# Altium project uz_d_absolute_encoder.PrjPCB
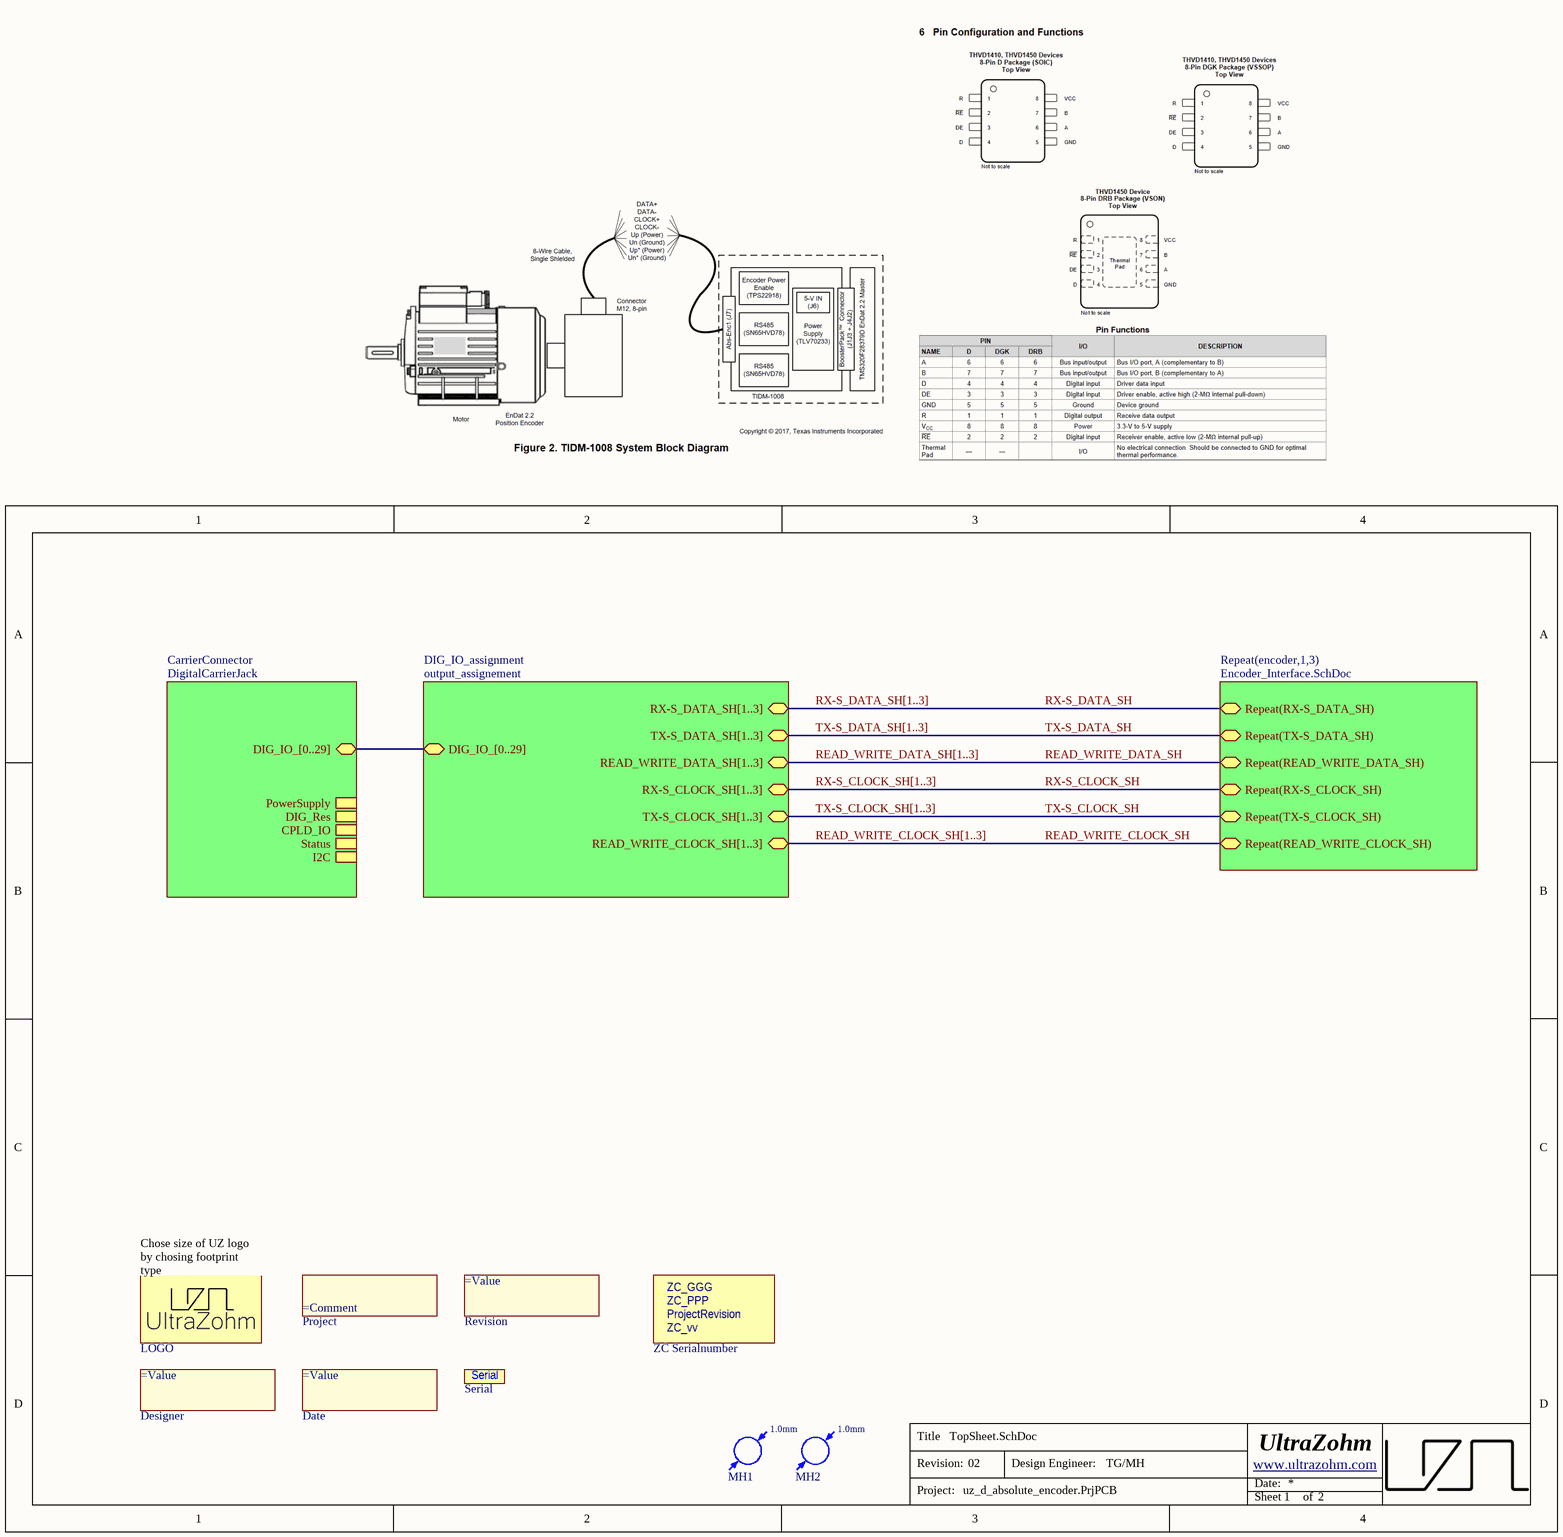
[diagram p0: TopSheet.SchDoc]
ZC_vv: 00; ZC_PPP: 017; ZC_GGG: 000; ProjectRevision: 02; ProjectNameCustom: uz_d_absolute_encoder; FinDate: 05/25; AuthorParam: TG/MH; Author: TG/MH
4 sheets, 211 parts. Net scope: hierarchical (ports join the sheet entries above them; power ports are global).
Board file: uz_d_absolute_encoder.PcbDoc
Sheets:
  TopSheet.SchDoc
    CarrierConnector = DigitalCarrierJack.SchDoc
    DIG_IO_assignment = output_assignement.SchDoc
    encoder1 = Encoder_Interface.SchDoc
    encoder2 = Encoder_Interface.SchDoc
    encoder3 = Encoder_Interface.SchDoc

## Sheet TopSheet.SchDoc
size A4; Author: TG/MH; CompanyName: Technische Hochschule Nürnberg Georg Simon Ohm; Organization: UltraZohm; Address1: Kesslerplatz 12; Address2: 90489 Nürnberg; Address3: GERMANY; DocumentNumber: 1; SheetNumber: 1; SheetTotal: 2; Website: www.ultrazohm.com

### Parts
Date  (no value)  [COMMENT]  (no BOM)
Designer  (no value)  [Designator:comment]  (no BOM)
INFO  ZC Serialnumber  [ZC-Serial]  (no BOM)
LOGO  UZ Logo  [UZ_Logo_small]  (value not drawn)  (no BOM)
MH1  alignment hole 1mm  [MH_1]  (value not drawn)  (no BOM)
MH2  alignment hole 1mm  [MH_1]  (value not drawn)  (no BOM)
Project  (no value)  [COMMENT]  (no BOM)
Revision  (no value)  [Designator:comment]  (no BOM)
Serial  Serial #  [SERIAL]  (value not drawn)  (no BOM)

### Sub-sheets
CarrierConnector = DigitalCarrierJack: PowerSupply (harness DigCon_PowerSupply), DIG_Res (harness DigCon_DIG_Res), CPLD_IO (harness DigCon_DCPLD_IO), Status (harness DigCon_Status), I2C (harness DigCon_I2C), DIG_IO_[0..29] (bidir)
DIG_IO_assignment = output_assignement: TX-S_DATA_SH[1..3] (bidir), READ_WRITE_DATA_SH[1..3] (bidir), RX-S_CLOCK_SH[1..3] (bidir), RX-S_DATA_SH[1..3] (bidir), TX-S_CLOCK_SH[1..3] (bidir), READ_WRITE_CLOCK_SH[1..3] (bidir), DIG_IO_[0..29] (bidir)
Repeat(encoder,1,3) = Encoder_Interface.SchDoc: Repeat(TX-S_DATA_SH) (bidir), Repeat(READ_WRITE_DATA_SH) (bidir), Repeat(RX-S_CLOCK_SH) (bidir), Repeat(RX-S_DATA_SH) (bidir), Repeat(TX-S_CLOCK_SH) (bidir), Repeat(READ_WRITE_CLOCK_SH) (bidir)

### Nets
READ_WRITE_CLOCK_SH: sheet Repeat(encoder,1,3)/Repeat(READ_WRITE_CLOCK_SH)
READ_WRITE_DATA_SH: sheet Repeat(encoder,1,3)/Repeat(READ_WRITE_DATA_SH)
RX-S_CLOCK_SH: sheet Repeat(encoder,1,3)/Repeat(RX-S_CLOCK_SH)
RX-S_DATA_SH: sheet Repeat(encoder,1,3)/Repeat(RX-S_DATA_SH)
TX-S_CLOCK_SH: sheet Repeat(encoder,1,3)/Repeat(TX-S_CLOCK_SH)
TX-S_DATA_SH: sheet Repeat(encoder,1,3)/Repeat(TX-S_DATA_SH)

### Buses and harness runs
bus READ_WRITE_CLOCK_SH[1..3] = sheet DIG_IO_assignment/READ_WRITE_CLOCK_SH[1..3]
bus READ_WRITE_DATA_SH[1..3] = sheet DIG_IO_assignment/READ_WRITE_DATA_SH[1..3]
bus RX-S_CLOCK_SH[1..3] = sheet DIG_IO_assignment/RX-S_CLOCK_SH[1..3]
bus RX-S_DATA_SH[1..3] = sheet DIG_IO_assignment/RX-S_DATA_SH[1..3]
bus sheet CarrierConnector/DIG_IO_[0..29] = sheet DIG_IO_assignment/DIG_IO_[0..29]
bus TX-S_CLOCK_SH[1..3] = sheet DIG_IO_assignment/TX-S_CLOCK_SH[1..3]
bus TX-S_DATA_SH[1..3] = sheet DIG_IO_assignment/TX-S_DATA_SH[1..3]

### Notes on the sheet
- (near LOGO) Chose size of UZ logo by chosing footprint type
- Title
- Revision:
- Design Engineer:
- Date:
- Project:
- Sheet
- of
- (in symbol Mounting Hole - 1mm) 1.0mm
- (in symbol ZC-Serial) ZC_GGG; ZC_PPP; ProjectRevision; ZC_vv

### Library data of the parts
Date = 5: Create a project parameter named "FinDate" this is the value of this component. It is printed on the PCB. Once the parameter is updated (e.g. new revision) it gets updated on the PCB as well; Manufacturer: PCB Manufacturer; Manufacturer Part Number: Project End Date; Value: 05/25; Created from: T. Wendt; PartID: 5; Created On: 01.03.2021 09:01:41; Component Type: Date of Project Finalization; Last Updated: 01.03.2021 09:01:41; Type: Standard (No BOM); Live Cycle Status: 1
Designer = 4: Create a project parameter named "Author" this is the value of this component. It is printed on the PCB. Once the parameter is updated (e.g. new revision) it gets updated on the PCB as well; Manufacturer: PCB Manufacturer; Manufacturer Part Number: Project Author; Value: TG/MH; Created from: T. Wendt; PartID: 4; Created On: 01.03.2021 08:53:41; Component Type: Project Author; Last Updated: 01.03.2021 09:20:27; Type: Standard (No BOM); Live Cycle Status: 1
INFO = ZC-Serial: Manufacturer: UltraZohm; Value: GGG-PPP-VVvv; Created from: FRosner; Manufacturer Part Number: ZC-Serial; PartID: 58; Created On: 15.04.2025 09:17:14; ComponentLink1Description: https://docs.ultrazohm.com/; ComponentLink1URL: homepage; Component Type: ZC Serialnumber; Last Updated: 15.04.2025 09:17:14; Supplier 1: -; Supplier Part Number 1: -; Type: Serial Number; Live Cycle Status: 1
LOGO = 1: Official Project Logo of the UltraZohm; Manufacturer: PCB Manufacturer; Manufacturer Part Number: UltraZohm Logo; Created from: T. Wendt; PartID: 1; Created On: 19.02.2021 16:55:56; ComponentLink1Description: Homepage; ComponentLink1URL: https://ultrazohm.com; Component Type: Logo; Last Updated: 02.03.2021 14:31:24; Type: Standard (No BOM); Live Cycle Status: 1
MH1 MH2 = Mounting Hole - 1mm: Non plated through hole, 1mm
Project = 2: Create a project parameter named "ProjectNameCustom" this is the value of this component and it is printed on the PCB.; Manufacturer: PCB Manufacturer; Value: uz_d_absolute_encoder; Created from: T. Wendt; PartID: 2; Created On: 01.03.2021 08:43:57; Component Type: Project Name; Last Updated: 01.03.2021 09:07:27; Manufacturer Part Number: Project Name; Type: Standard (No BOM); Live Cycle Status: 1
Revision = 3: Create a project parameter named "ProjectRevision" this is the value of this component. It is printed on the PCB. Once the parameter is updated (e.g. new revision) it gets updated on the PCB as well; Manufacturer: PCB Manufacturer; Value: 02; Created from: T. Wendt; PartID: 3; Created On: 01.03.2021 08:50:34; Component Type: Project Revision; Last Updated: 01.03.2021 09:28:36; Manufacturer Part Number: Project Revision; Type: Standard (No BOM); Live Cycle Status: 1
Serial = 6: Field to put in a serial number; Manufacturer: PCB Manufacturer; Created from: T. Wendt; PartID: 6; Created On: 02.03.2021 14:31:24; Component Type: Serial Number; Last Updated: 02.03.2021 14:31:24; Manufacturer Part Number: Serial Number; Type: Standard (No BOM); Live Cycle Status: 1

## Sheet DigitalCarrierJack.SchDoc
size A4; Author: TG/MH; CompanyName: Technische Hochschule Nürnberg Georg Simon Ohm; Organization: UltraZohm; Address1: Kesslerplatz 12; Address2: 90489 Nürnberg; Address3: GERMANY; DocumentNumber: 2; SheetNumber: 2; SheetTotal: 2; Website: www.ultrazohm.com
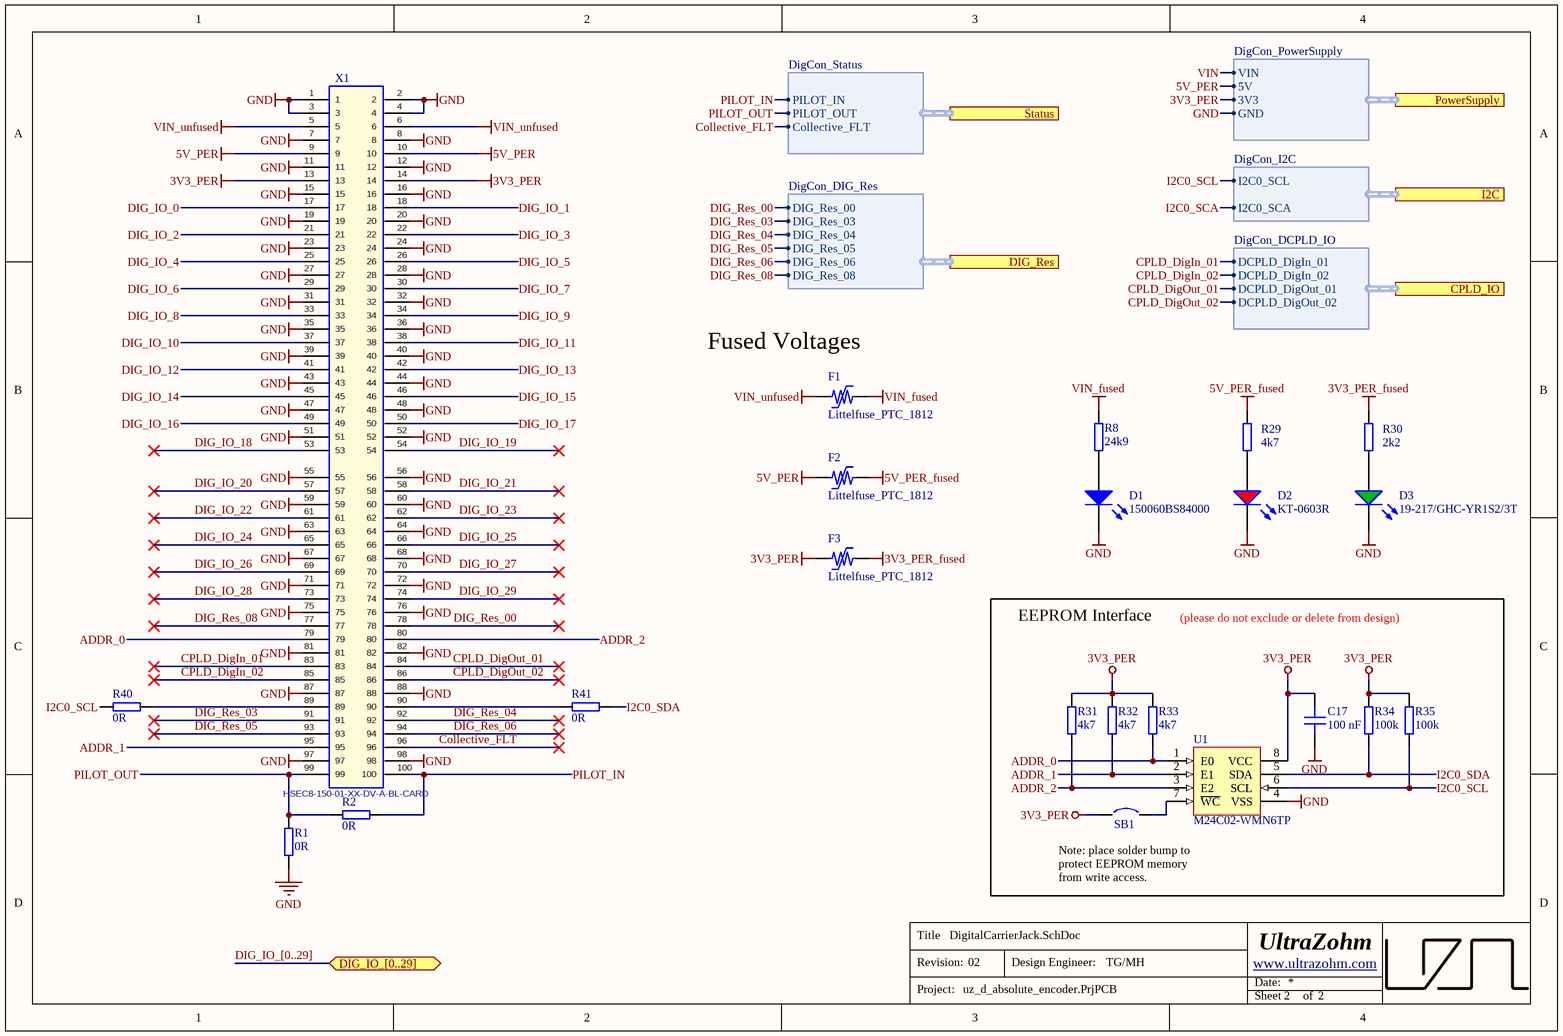
[diagram p1: DigitalCarrierJack.SchDoc]

### Parts
C17  100 nF  [C_0603]
D1  150060BS84000  [WL-SMCW_0603]
D2  KT-0603R  [WL-SMCW_0603]
D3  19-217/GHC-YR1S2/3T  [WL-SMCW_0603]
F1  Littelfuse_PTC_1812  [1812_PTC_Polyfuse_Littelfuse]
F2  Littelfuse_PTC_1812  [1812_PTC_Polyfuse_Littelfuse]
F3  Littelfuse_PTC_1812  [1812_PTC_Polyfuse_Littelfuse]
R1  0R  [RES 0603_1608]
R2  0R  [RES 0603_1608]
R8  24k9  [RES 0603_1608]
R29  4k7  [RES 0603_1608]
R30  2k2  [RES 0603_1608]
R31  4k7  [RES 0603_1608]
R32  4k7  [RES 0603_1608]
R33  4k7  [RES 0603_1608]
R34  100k  [RES 0603_1608]
R35  100k  [RES 0603_1608]
R40  0R  [RES 0603_1608]
R41  0R  [RES 0603_1608]
SB1  Solder Bump 0603  [SB_0603]  (value not drawn)  (no BOM)
U1  M24C02-WMN6TP  [D0008A_N]
X1  HSEC8-150-01-XX-DV-A-BL-CARD  [HSEC8-150-01-XX-DV-A-BL-CARD]  (no BOM)

### Blocks framed on the sheet
EEPROM Interface: C17 R31-R35 SB1 U1

### Ports
CPLD_IO (harness DigCon_DCPLD_IO), DIG_IO_[0..29] (bidir), DIG_Res (harness DigCon_DIG_Res), I2C (harness DigCon_I2C), PowerSupply (harness DigCon_PowerSupply), Status (harness DigCon_Status)

### Harnesses
DigCon_PowerSupply: GND, 3V3, 5V, VIN
DigCon_I2C: I2C0_SCA, I2C0_SCL
DigCon_Status: PILOT_IN, PILOT_OUT, Collective_FLT
DigCon_DCPLD_IO: DCPLD_DigIn_01, DCPLD_DigIn_02, DCPLD_DigOut_01, DCPLD_DigOut_02
DigCon_DIG_Res: DIG_Res_03, DIG_Res_04, DIG_Res_05, DIG_Res_06, DIG_Res_00, DIG_Res_08

### Nets
3V3_PER: C17.2 F3.1 R31.2 R32.2 R33.2 R34.2 R35.2 SB1.1 U1.8(VCC) X1.13 X1.14 ; port PowerSupply.3V3
3V3_PER_fused: F3.2 R30.2
5V_PER: F2.1 X1.9 X1.10 ; port PowerSupply.5V
5V_PER_fused: F2.2 R29.2
GND: C17.1 D1.1(K) D2.1(K) D3.1(K) R1.1 U1.4(VSS) X1.1 X1.2 X1.3 X1.4 X1.7 X1.8 X1.11 X1.12 X1.15 X1.16 X1.19 X1.20 X1.23 X1.24 X1.27 X1.28 X1.31 X1.32 X1.35 X1.36 X1.39 X1.40 X1.43 X1.44 X1.47 X1.48 X1.51 X1.52 X1.55 X1.56 X1.59 X1.60 X1.63 X1.64 X1.67 X1.68 X1.71 X1.72 X1.75 X1.76 X1.81 X1.82 X1.87 X1.88 X1.97 X1.98 ; port PowerSupply.GND
VIN_fused: F1.2 R8.2
VIN_unfused: F1.1 X1.5 X1.6
ADDR_0: R33.1 U1.1(E0) X1.79
ADDR_1: R32.1 U1.2(E1) X1.95
ADDR_2: R31.1 U1.3(E2) X1.80
Collective_FLT: X1.96 ; port Status.Collective_FLT
CPLD_DigIn_01: X1.83 ; port CPLD_IO.DCPLD_DigIn_01
CPLD_DigIn_02: X1.85 ; port CPLD_IO.DCPLD_DigIn_02
CPLD_DigOut_01: X1.84 ; port CPLD_IO.DCPLD_DigOut_01
CPLD_DigOut_02: X1.86 ; port CPLD_IO.DCPLD_DigOut_02
DIG_IO_0: X1.17
DIG_IO_1: X1.18
DIG_IO_2: X1.21
DIG_IO_3: X1.22
DIG_IO_4: X1.25
DIG_IO_5: X1.26
DIG_IO_6: X1.29
DIG_IO_7: X1.30
DIG_IO_8: X1.33
DIG_IO_9: X1.34
DIG_IO_10: X1.37
DIG_IO_11: X1.38
DIG_IO_12: X1.41
DIG_IO_13: X1.42
DIG_IO_14: X1.45
DIG_IO_15: X1.46
DIG_IO_16: X1.49
DIG_IO_17: X1.50
DIG_IO_18: X1.53
DIG_IO_19: X1.54
DIG_IO_20: X1.57
DIG_IO_21: X1.58
DIG_IO_22: X1.61
DIG_IO_23: X1.62
DIG_IO_24: X1.65
DIG_IO_25: X1.66
DIG_IO_26: X1.69
DIG_IO_27: X1.70
DIG_IO_28: X1.73
DIG_IO_29: X1.74
DIG_Res_00: X1.78 ; port DIG_Res.DIG_Res_00
DIG_Res_03: X1.91 ; port DIG_Res.DIG_Res_03
DIG_Res_04: X1.92 ; port DIG_Res.DIG_Res_04
DIG_Res_05: X1.93 ; port DIG_Res.DIG_Res_05
DIG_Res_06: X1.94 ; port DIG_Res.DIG_Res_06
DIG_Res_08: X1.77 ; port DIG_Res.DIG_Res_08
I2C0_SCA: port I2C.I2C0_SCA
I2C0_SCL: R35.1 R40.2 U1.6(SCL) ; port I2C.I2C0_SCL
I2C0_SDA: R34.1 R41.1 U1.5(SDA)
PILOT_IN: R2.1 X1.100 ; port Status.PILOT_IN
PILOT_OUT: R1.2 R2.2 X1.99 ; port Status.PILOT_OUT
VIN: port PowerSupply.VIN
NetD1_2: D1.2(A) R8.1
NetD2_2: D2.2(A) R29.1
NetD3_2: D3.2(A) R30.1
NetR40_1: R40.1 X1.89
NetR41_2: R41.2 X1.90
NetSB1_2: SB1.2 U1.7(~{WC})

### Buses and harness runs
bus DIG_IO_[0..29] = port DIG_IO_[0..29]

### Notes on the sheet
- (near F1) Fused Voltages
- (please do not exclude or delete from design)
- Note: place solder bump to protect EEPROM memory from write access.
- Title
- Revision:
- Design Engineer:
- Date:
- Project:
- Sheet
- of

### Library data of the parts
C17 = CC0603KRX7R9BB104: Capacitor 0603, 50 VDC, 100 nF, X7R; Manufacturer: YAGEO; Tolerance: 10 %; Voltage Rating: 50 VDC; Created from: AGeiger; Manufacturer Part Number: CC0603KRX7R9BB104; PartID: 102; Created On: 22.08.2022 14:35:53; ComponentLink1Description: Datasheet; ComponentLink1URL: https://datasheet.lcsc.com/lcsc/1809301912_YAGEO-CC0603KRX7R9BB104_C14663.pdf; Component Type: Capacitor 0603; Device Package: 0603; Last Updated: 22.08.2022 14:35:53; Mounting Type: SMD; Operating Temperature: -55 - 125°C; Series: X7R; Supplier 1: LCSC; Supplier Part Number 1: C14663; Supplier 2: Mouser; Supplier Part Number 2: 603-CC603KRX7R9BB104; Type: Capacitor; Value: 100 nF; Live Cycle Status: 1; LCSC Part Number: C14663
D1 = 150060BS84000: WL-SMCW SMD Mono-color Chip LED Waterclear Blue; Manufacturer: Wuerth Elektronik; Type: Standard; Created from: MGremer; Forward Current I_f: 20 mA; Forward Voltage U_f: 3.2 V; Wavelength: 470 nm; Light Intensity: 560 mcd; Nominal Power: 78 mW; Manufacturer Part Number: 150060BS84000; PartID: 1; Created On: 08.12.2020 10:19:38; ComponentLink1Description: Datasheet; ComponentLink1URL: https://www.mouser.de/datasheet/2/445/150060BS84000-1838909.pdf; Component Type: LED Diode; Device Package: 0603; Last Updated: 03.03.2021 09:59:51; Mounting Type: SMD; Operating Temperature: -40 - 85 °C; Supplier 1: Mouser; Supplier Part Number 1: 710-150060BS84000; Supplier 2: Farnell; Supplier Part Number 2: 3408611; Supplier 3: Digi-Key; Supplier Part Number 3: 732-150060BS84000CT-ND; Live Cycle Status: 1; Stock number: not stored; Color: blue
D2 = KT-0603R: LED RED 520~625NM 90~100MCD@20MA TOP VIEW 0603 ROHS; Manufacturer: Hubei KENTO Elec; Type: Standard; Created from: T. Wendt; Forward Current I_f: 20 mA; Forward Voltage U_f: 2.1 V; Wavelength: 620 nm; Light Intensity: 110 mcd; Nominal Power: 42 mW; Manufacturer Part Number: KT-0603R; PartID: 8; Created On: 03.03.2021 10:06:23; ComponentLink1Description: Datasheet; ComponentLink1URL: https://datasheet.lcsc.com/szlcsc/Hubei-KENTO-Elec-KT-0603R_C2286.pdf; Component Type: LED Diode; Device Package: 0603; Last Updated: 04.03.2021 09:02:49; Mounting Type: SMD; Operating Temperature: -40 - 85 °C; Supplier 1: LCSC; Supplier Part Number 1: C2286; Live Cycle Status: 1; Stock number: not stored; Color: red; LCSC Part Number: C2286
D3 = 19-217/GHC-YR1S2/3T: LED GREEN 520~535NM 112~258MCD@20MA TOP VIEW 0603 ROHS; Manufacturer: Everlight Elec; Type: Standard; Created from: T. Wendt; Forward Current I_f: 20 mA; Forward Voltage U_f: 3.3 V; Wavelength: 530 nm; Light Intensity: 285 mcd; Nominal Power: 83 mW; Manufacturer Part Number: 19-217/GHC-YR1S2/3T; PartID: 7; Created On: 03.03.2021 10:06:23; ComponentLink1Description: Datasheet; ComponentLink1URL: https://datasheet.lcsc.com/szlcsc/Everlight-Elec-19-217-GHC-YR1S2-3T_C72043.pdf; Component Type: LED Diode; Device Package: 0603; Last Updated: 04.03.2021 09:02:49; Mounting Type: SMD; Operating Temperature: -40 - 85 °C; Supplier 1: LCSC; Supplier Part Number 1: C72043; Supplier 2: Mouser; Supplier Part Number 2: 638-19217GHCYR1S23T; Live Cycle Status: 1; Stock number: not stored; Color: green; LCSC Part Number: C72043
F1-F3 = Littelfuse_PTC_1812: POLYSWITCH RESETTABLE DEVICES; MPN: miniASMDC110F/24; Value: PTC, 1.1 A, 24V; Voltage: 24V; Trip Current: 2.2A; Hold Current: 1.1A; Resistance: 0.18 Ohm; Type: Fuse; Nominal current: 1 A; Created from: MHlatky; MF: Littelfuse; Created: 2019_02_10_AGeiger; Package: 1812; ComponentLink1URL: https://www.littelfuse.com/~/media/electronics/datasheets/resettable_ptcs/littelfuse_ptc_surface_mount_catalog_datasheet.pdf.pdf; ComponentLink1Description: Datasheet; Manufacturer Part Number: Littelfuse_PTC_1812; PartID: 5; Created On: 07.05.2021 06:50:33; Component Type: Littelfuse_PTC_1812; Last Updated: 27.05.2022 15:06:17; Manufacturer: Littelfuse; Mounting Type: SMD; Operating Temperature: -40 - 85 °C; Supplier 1: Mouser; Supplier Part Number 1: 530-0ZCG0150BF2C; Live Cycle Status: 1; LCSC Part Number: C70119
R1 R2 R40 R41 = RC0603JR-070RL: SMD resistor E24 series; Manufacturer: YAGEO; Tolerance: 5%; Created from: MGremer; Manufacturer Part Number: RC0603JR-070RL; PartID: 1; Created On: 14.12.2020 16:17:14; ComponentLink1Description: Datasheet; ComponentLink1URL: https://www.mouser.de/datasheet/2/447/PYu-RC_Group_51_RoHS_L_10-1664068.pdf; Component Type: SMD resistor; Device Package: 0603; Last Updated: 04.03.2021 09:09:42; Mounting Type: SMD; Supplier 1: Mouser; Supplier Part Number 1: 603-RC0603JR-070RL; Supplier 2: LCSC; Supplier Part Number 2: C21189; Type: Resistor; Value: 0R; Live Cycle Status: 1; Stock number: Labor SMD Container; LCSC Part Number: C21189
R8 = CRCW060324K9FKEA: SMD resistor 1%; Manufacturer: Vishay; Created from: MGremer; Manufacturer Part Number: CRCW060324K9FKEA; PartID: 157; Created On: 14.12.2020 16:17:14; ComponentLink1Description: Datasheet; ComponentLink1URL: https://www.mouser.de/datasheet/2/427/dcrcwe3-1762152.pdf; Component Type: SMD resistor; Device Package: 0603; Last Updated: 02.03.2021 14:07:32; Mounting Type: SMD; Supplier 1: Mouser; Supplier Part Number 1: 71-CRCW0603-24.9K-E3; Type: Resistor; Tolerance: 1%; Value: 24k9; Live Cycle Status: 1; Stock number: not stored
R29 R31-R33 = 0603WAF4701T5E: SMD resistor E24 series; Manufacturer: UNI-ROYAL; Tolerance: 1%; Created from: AGeiger; Value: 4k7; Supplier 1: LCSC; Supplier Part Number 1: C23162; Manufacturer Part Number: 0603WAF4701T5E; PartID: 90; Created On: 14.12.2020 16:17:14; ComponentLink1Description: Datasheet; ComponentLink1URL: https://datasheet.lcsc.com/lcsc/2206010116_UNI-ROYAL-Uniroyal-Elec-0603WAF4701T5E_C23162.pdf; Component Type: SMD resistor; Device Package: 0603; Last Updated: 25.08.2022 20:03:04; Mounting Type: SMD; Type: Resistor; Live Cycle Status: 1; Stock number: Labor SMD Container; LCSC Part Number: C23162
R30 = RK73B1JTTD222J: SMD resistor E24 series; Manufacturer: KOA Speer; Tolerance: 5%; Created from: MGremer; Value: 2k2; Supplier 1: Mouser; Supplier Part Number 1: 660-RK73B1JTTD222J; Manufacturer Part Number: RK73B1JTTD222J; PartID: 82; Created On: 14.12.2020 16:17:14; ComponentLink1Description: Datasheet; ComponentLink1URL: https://www.mouser.de/datasheet/2/219/RK73B-1825463.pdf; Component Type: SMD resistor; Device Package: 0603; Last Updated: 31.01.2023 21:49:41; Mounting Type: SMD; Type: Resistor; Live Cycle Status: 1; Stock number: Labor SMD Container; LCSC Part Number: C4190
R34 R35 = RK73B1JTTD104J: SMD resistor E24 series; Manufacturer: KOA Speer; Tolerance: 5%; Created from: MGremer; Manufacturer Part Number: RK73B1JTTD104J; PartID: 122; Created On: 14.12.2020 16:17:14; ComponentLink1Description: Datasheet; ComponentLink1URL: https://www.mouser.de/datasheet/2/219/RK73B-1825463.pdf; Component Type: SMD resistor; Device Package: 0603; Last Updated: 27.05.2022 14:04:10; Mounting Type: SMD; Supplier 1: Mouser; Supplier Part Number 1: 660-RK73B1JTTD104J; Type: Resistor; Value: 100k; Live Cycle Status: 1; Stock number: Labor SMD Container; LCSC Part Number: C25803
SB1 = =Value: Created from: AGeiger; Revision: July-2002: Re-released for DXP Platform.; PartID: 1; Created On: 09.01.2024 17:13:56; Component Type: Solder Bump; Device Package: 0603; Last Updated: 09.01.2024 17:13:56; Manufacturer Part Number: Solder Bump 0603; Mounting Type: SMD; Value: Solder Bump 0603
U1 = M24C02-WMN6TP: 2Kbit I2C SOP-8 EEPROM ROHS; Manufacturer: STMicroelectronics; Created from: AGeiger; Manufacturer Part Number: M24C02-WMN6TP; PartID: 1; Created On: 19.11.2023 14:54:27; ComponentLink1Description: Datasheet; ComponentLink1URL: https://www.st.com/resource/en/datasheet/m24c01-w.pdf; Component Type: EEPROM; Device Package: SOIC-8; Last Updated: 19.11.2023 21:39:04; Mounting Type: SMD; Operating Temperature: -40 to +85 °C; Series: M24xxx; Supplier 1: Mouser; Supplier Part Number 1: 511-M24C02-WMN6TP; Supplier 2: LCSC; Supplier Part Number 2: C7562; Type: Memory; Value: M24C02-WMN6TP; LCSC Part Number: C7562
X1 = HSEC8-150-01-XX-DV-A-BL-CARD: Mating Card Layout for HSEC8-150-01-XX-DV-A-BL; Manufacturer: SAMTEC; Created: 2018_04_23_AGeiger; Value: HSEC8-150-01-XX-DV-A-BL-CARD

## Sheet output_assignement.SchDoc
size A4; Author: TG/MH; CompanyName: Technische Hochschule Nürnberg Georg Simon Ohm; Organization: UltraZohm; Address1: Kesslerplatz 12; Address2: 90489 Nürnberg; Address3: GERMANY; Website: www.ultrazohm.com
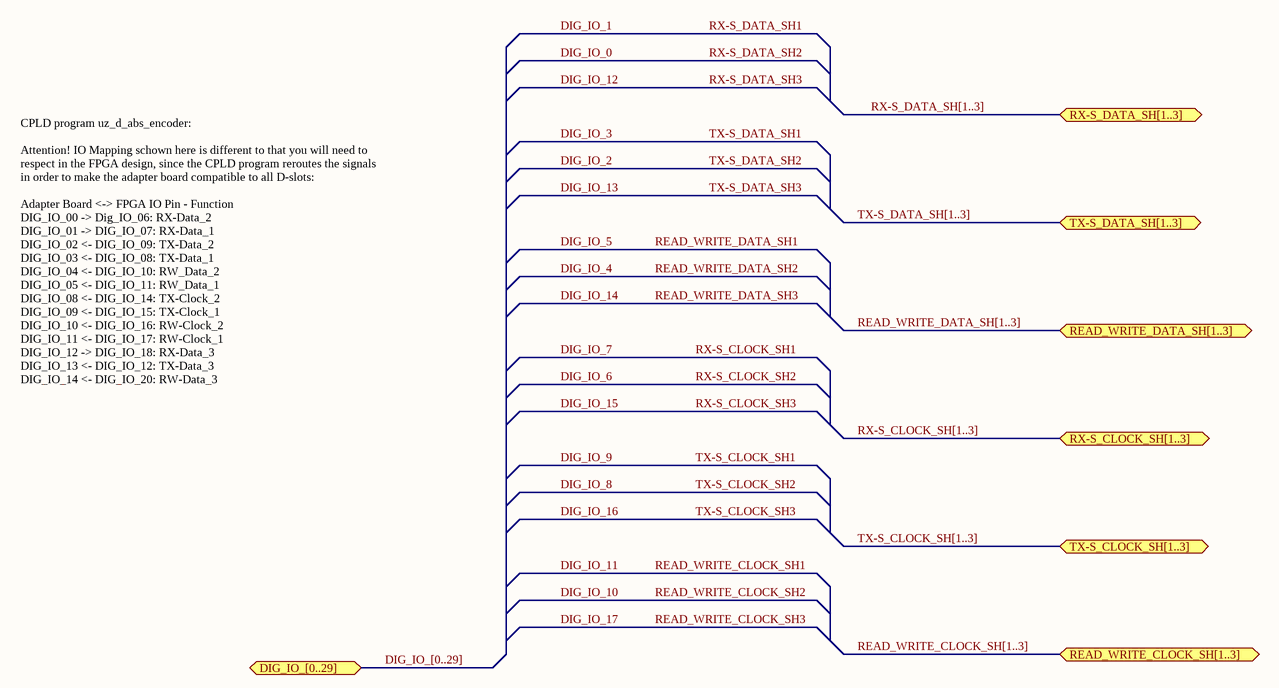
[diagram p2: output_assignement.SchDoc]

### Ports
DIG_IO_[0..29] (bidir), READ_WRITE_CLOCK_SH[1..3] (bidir), READ_WRITE_DATA_SH[1..3] (bidir), RX-S_CLOCK_SH[1..3] (bidir), RX-S_DATA_SH[1..3] (bidir), TX-S_CLOCK_SH[1..3] (bidir), TX-S_DATA_SH[1..3] (bidir)

### Buses and harness runs
bus DIG_IO_[0..29] = port DIG_IO_[0..29]
bus READ_WRITE_CLOCK_SH[1..3] = port READ_WRITE_CLOCK_SH[1..3]
bus READ_WRITE_DATA_SH[1..3] = port READ_WRITE_DATA_SH[1..3]
bus RX-S_CLOCK_SH[1..3] = port RX-S_CLOCK_SH[1..3]
bus RX-S_DATA_SH[1..3] = port RX-S_DATA_SH[1..3]
bus TX-S_CLOCK_SH[1..3] = port TX-S_CLOCK_SH[1..3]
bus TX-S_DATA_SH[1..3] = port TX-S_DATA_SH[1..3]

### Notes on the sheet
- CPLD program uz_d_abs_encoder:
  Attention! IO Mapping schown here is different to that you will need to respect in the FPGA design, since the CPLD program reroutes the signals in order to make the adapter board compatible to all D-slots:
  Adapter Board <-> FPGA IO Pin - Function
  DIG_IO_00 -> Dig_IO_06: RX-Data_2
  DIG_IO_01 -> DIG_IO_07: RX-Data_1
  DIG_IO_02 <- DIG_IO_09: TX-Data_2
  DIG_IO_03 <- DIG_IO_08: TX-Data_1
  DIG_IO_04 <- DIG_IO_10: RW_Data_2
  DIG_IO_05 <- DIG_IO_11: RW_Data_1
  DIG_IO_08 <- DIG_IO_14: TX-Clock_2
  DIG_IO_09 <- DIG_IO_15: TX-Clock_1
  DIG_IO_10 <- DIG_IO_16: RW-Clock_2
  DIG_IO_11 <- DIG_IO_17: RW-Clock_1
  DIG_IO_12 -> DIG_IO_18: RX-Data_3
  DIG_IO_13 <- DIG_IO_12: TX-Data_3
  DIG_IO_14 <- DIG_IO_20: RW-Data_3
  DIG_IO_16 <- DIG_IO_22: TX-Clock_3
  DIG_IO_17 <- DIG_IO_23: RW-Clock_3
- Title
- Revision:
- Design Engineer:
- Date:
- Project:
- Sheet
- of

## Sheet Encoder_Interface.SchDoc
size A4; Author: TG/MH; CompanyName: Technische Hochschule Nürnberg Georg Simon Ohm; Organization: UltraZohm; Address1: Kesslerplatz 12; Address2: 90489 Nürnberg; Address3: GERMANY; Website: www.ultrazohm.com
Used 3 times, as channels encoder1, encoder2, encoder3. Parts and nets are listed once, with the designators drawn on the sheet.
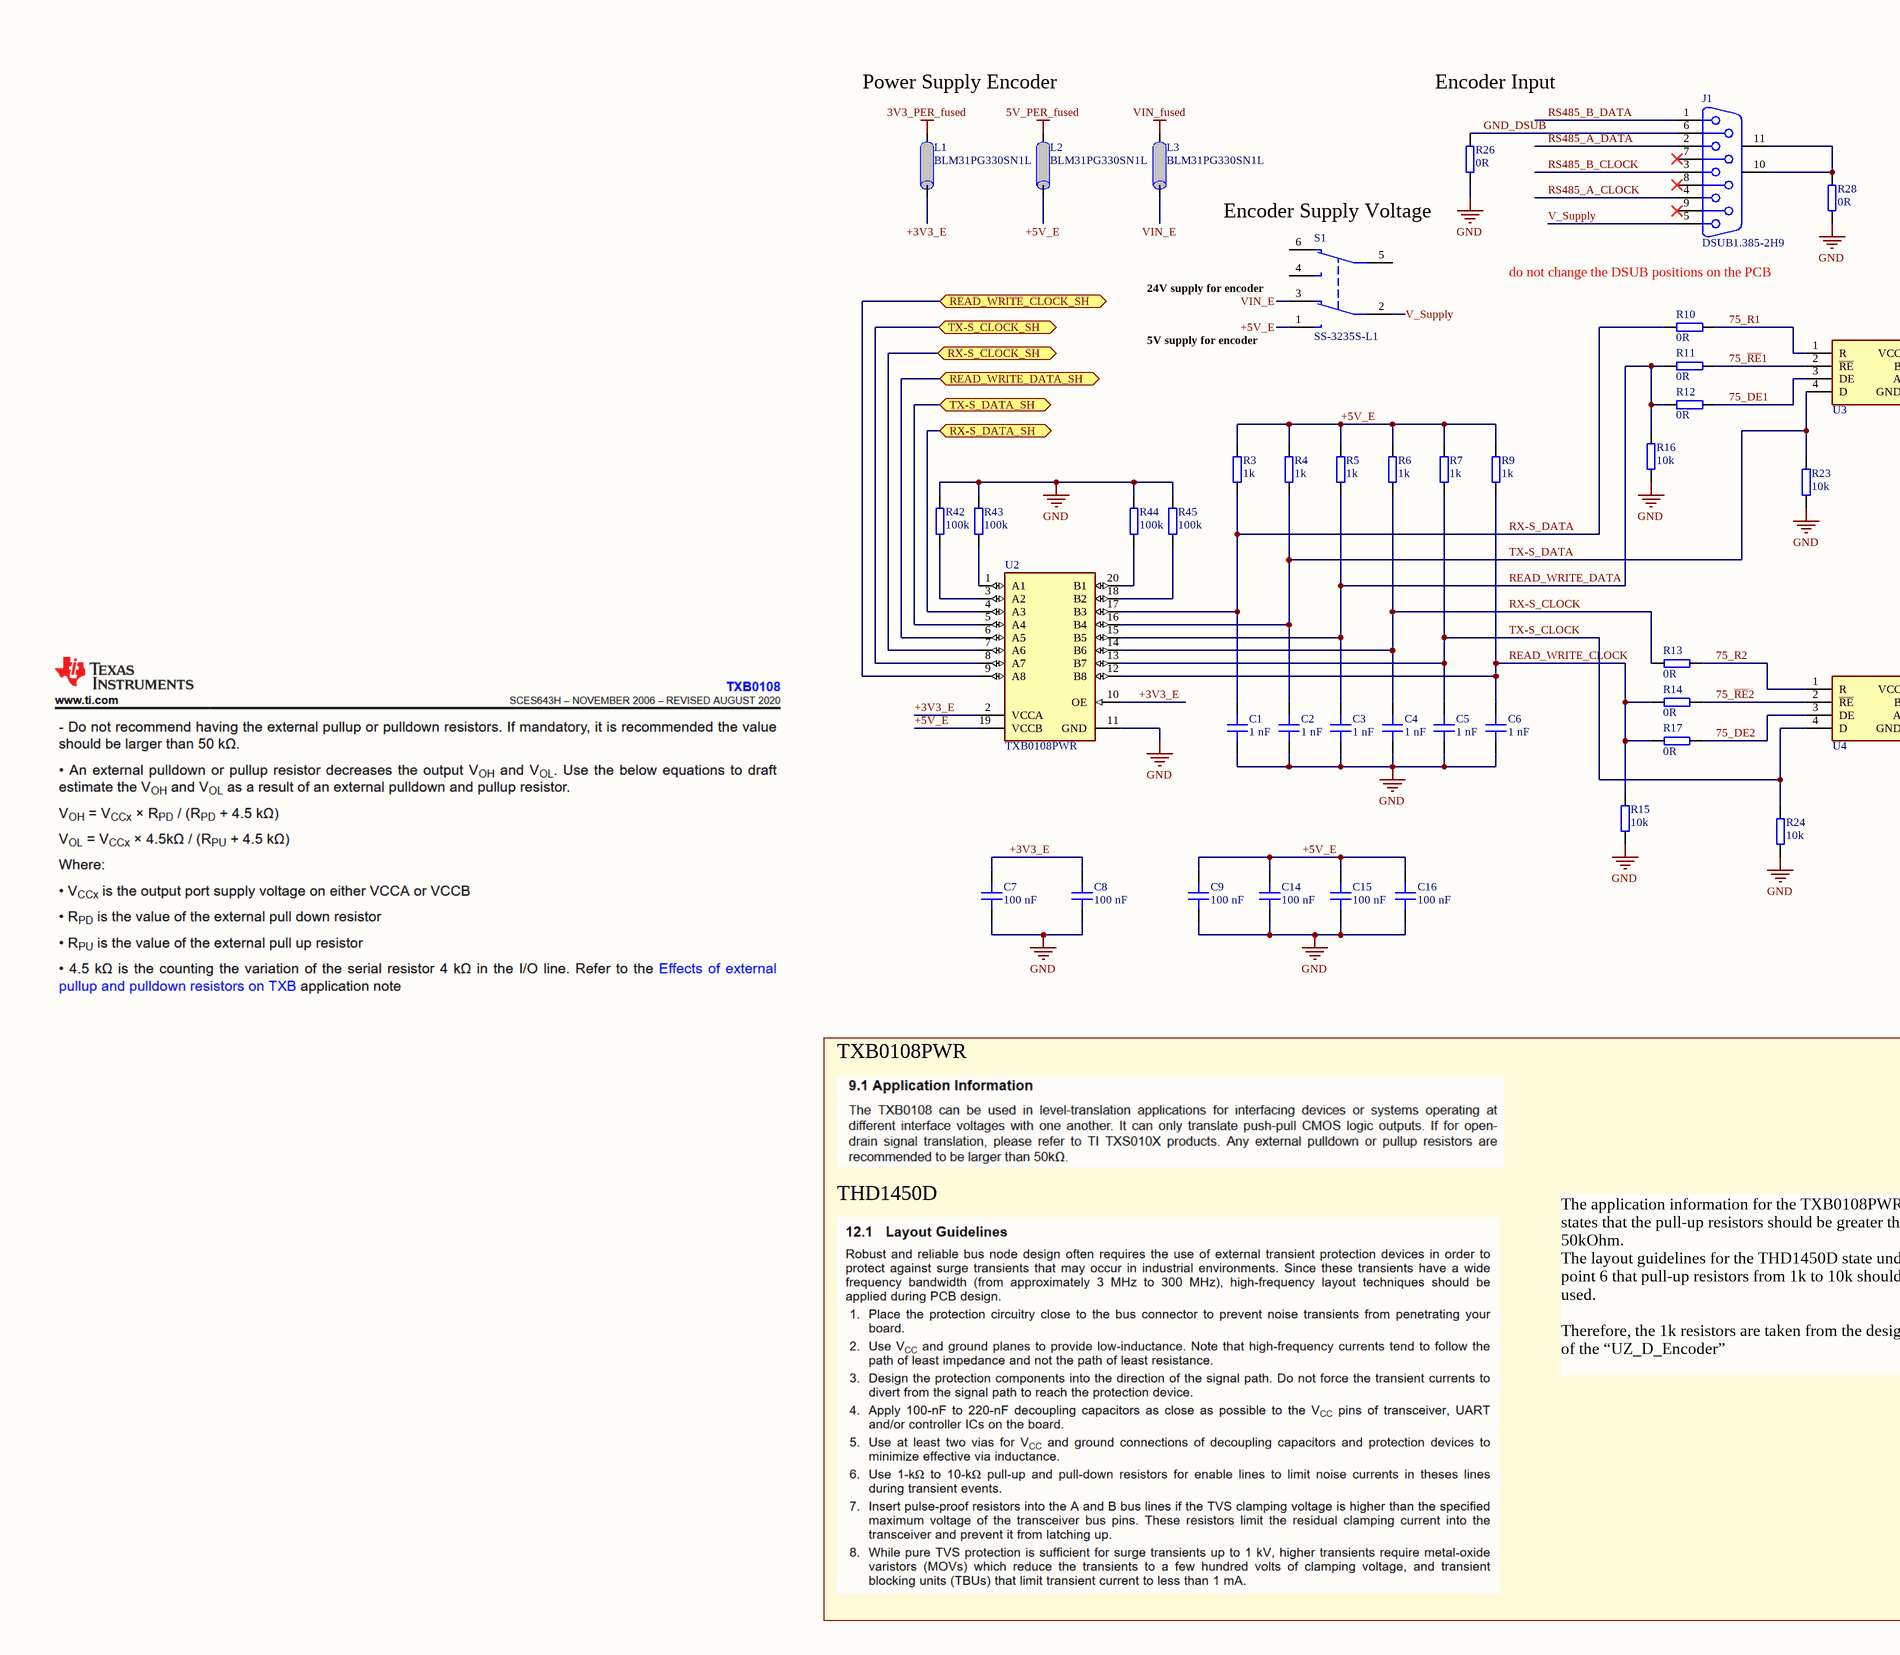
[diagram p3: Encoder_Interface.SchDoc, left]
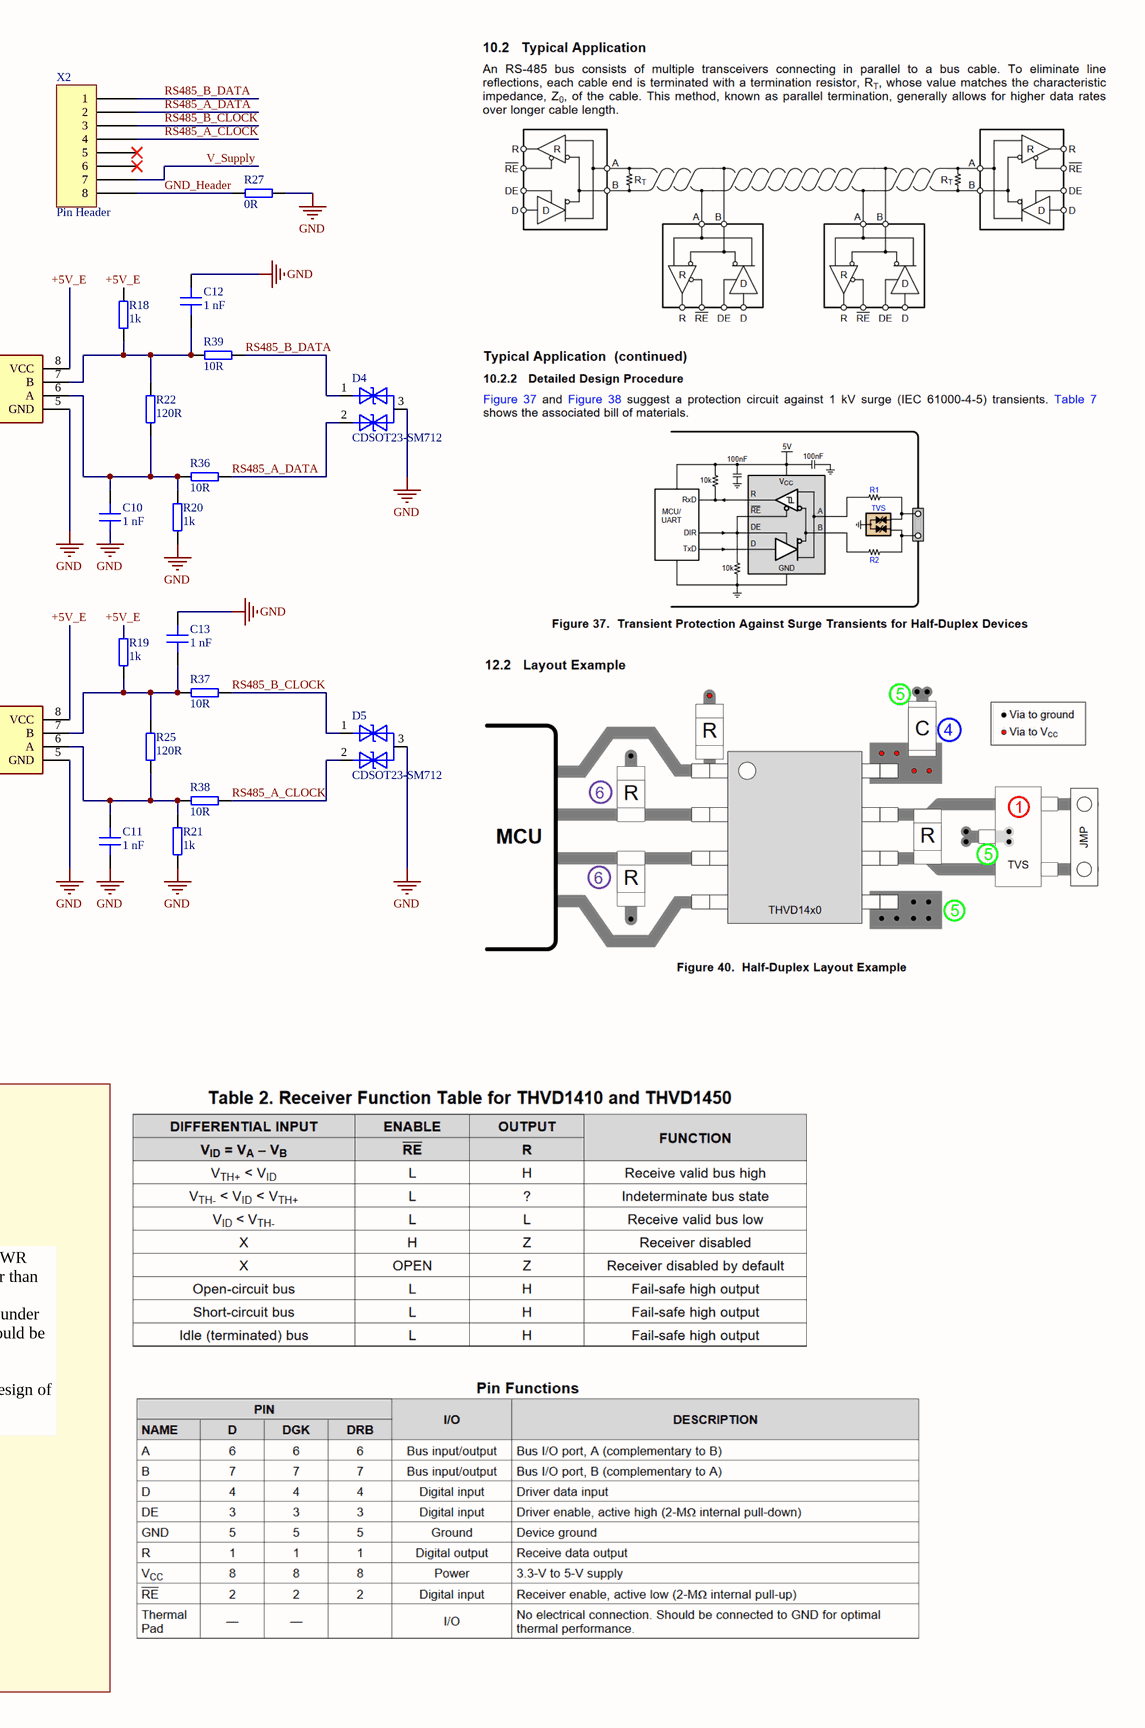
[diagram p4: Encoder_Interface.SchDoc, right]

### Parts
C1  1 nF  [C_0603]
C2  1 nF  [C_0603]
C3  1 nF  [C_0603]
C4  1 nF  [C_0603]
C5  1 nF  [C_0603]
C6  1 nF  [C_0603]
C7  100 nF  [C_0603]
C8  100 nF  [C_0603]
C9  100 nF  [C_0603]
C10  1 nF  [C_0603]
C11  1 nF  [C_0603]
C12  1 nF  [C_0603]
C13  1 nF  [C_0603]
C14  100 nF  [C_0603]
C15  100 nF  [C_0603]
C16  100 nF  [C_0603]
D4  CDSOT23-SM712  [SOT95P230X117-3N]
D5  CDSOT23-SM712  [SOT95P230X117-3N]
J1  DSUB1.385-2H9  [DSUB1.385-2H9]
L1  BLM31PG330SN1L  [IND 1206_3216]
L2  BLM31PG330SN1L  [IND 1206_3216]
L3  BLM31PG330SN1L  [IND 1206_3216]
R3  1k  [RES 0603_1608]
R4  1k  [RES 0603_1608]
R5  1k  [RES 0603_1608]
R6  1k  [RES 0603_1608]
R7  1k  [RES 0603_1608]
R9  1k  [RES 0603_1608]
R10  0R  [RES 0603_1608]
R11  0R  [RES 0603_1608]
R12  0R  [RES 0603_1608]
R13  0R  [RES 0603_1608]
R14  0R  [RES 0603_1608]
R15  10k  [RES 0603_1608]
R16  10k  [RES 0603_1608]
R17  0R  [RES 0603_1608]
R18  1k  [RES 0603_1608]
R19  1k  [RES 0603_1608]
R20  1k  [RES 0603_1608]
R21  1k  [RES 0603_1608]
R22  120R  [RES 0603_1608]
R23  10k  [RES 0603_1608]
R24  10k  [RES 0603_1608]
R25  120R  [RES 0603_1608]
R26  0R  [RES 0603_1608]
R27  0R  [RES 0603_1608]
R28  0R  [RES 0603_1608]
R36  10R  [RES 0603_1608]
R37  10R  [RES 0603_1608]
R38  10R  [RES 0603_1608]
R39  10R  [RES 0603_1608]
R42  100k  [RES 0603_1608]
R43  100k  [RES 0603_1608]
R44  100k  [RES 0603_1608]
R45  100k  [RES 0603_1608]
S1  SS-3235S-L1  [SS-3235S-L1]
U2  TXB0108PWR  [SOP65P640X120-20N]
U3  THVD1450DR  [SOIC127P600X175-8N]  (value not drawn)
U4  THVD1450DR  [SOIC127P600X175-8N]  (value not drawn)
X2  Pin Header  [HDR1X8]

### Ports
READ_WRITE_CLOCK_SH (bidir), READ_WRITE_DATA_SH (bidir), RX-S_CLOCK_SH (bidir), RX-S_DATA_SH (bidir), TX-S_CLOCK_SH (bidir), TX-S_DATA_SH (bidir)

### Nets
3V3_PER_fused: L1.1
5V_PER_fused: L2.1
GND: C1.1 C2.1 C3.1 C4.1 C5.1 C6.1 C7.1 C8.1 C9.1 C10.1 C11.1 C12.2 C13.2 C14.1 C15.1 C16.1 D4.3(A) D5.3(A) R15.1 R16.1 R20.1 R21.1 R23.1 R24.1 R26.2 R27.2 R28.1 R42.2 R43.2 R44.2 R45.2 U2.11(GND) U3.5(GND) U4.5(GND)
VIN_fused: L3.1
75_DE1: R12.2 U3.3(DE)
75_DE2: R17.2 U4.3(DE)
75_R1: R10.2 U3.1(R)
75_R2: R13.2 U4.1(R)
75_~{RE}1: R11.2 U3.2(~{RE})
75_~{RE}2: R14.2 U4.2(~{RE})
+3V3_E: C7.2 C8.2 L1.2 U2.2(VCCA) U2.10(OE)
+5V_E: C9.2 C14.2 C15.2 C16.2 L2.2 R3.2 R4.2 R5.2 R6.2 R7.2 R9.2 R18.2 R19.2 S1.1(NO1) U2.19(VCCB) U3.8(VCC) U4.8(VCC)
GND_DSUB: J1.6 R26.1
GND_Header: R27.1 X2.8
READ_WRITE_CLOCK: C6.2 R9.1 R14.1 R15.2 R17.1 U2.12(B8)
READ_WRITE_CLOCK_SH: U2.9(A8) ; port READ_WRITE_CLOCK_SH
READ_WRITE_DATA: C3.2 R5.1 R11.1 R12.1 R16.2 U2.15(B5)
READ_WRITE_DATA_SH: U2.6(A5) ; port READ_WRITE_DATA_SH
RS485_A_CLOCK: D5.2(K2) J1.4 R38.2 X2.4
RS485_A_DATA: D4.2(K2) J1.2 R36.2 X2.2
RS485_B_CLOCK: D5.1(K1) J1.3 R37.2 X2.3
RS485_B_DATA: D4.1(K1) J1.1 R39.2 X2.1
RX-S_CLOCK: C4.2 R6.1 R13.1 U2.14(B6)
RX-S_CLOCK_SH: U2.7(A6) ; port RX-S_CLOCK_SH
RX-S_DATA: C1.2 R3.1 R10.1 U2.17(B3)
RX-S_DATA_SH: U2.4(A3) ; port RX-S_DATA_SH
TX-S_CLOCK: C5.2 R7.1 R24.2 U2.13(B7) U4.4(D)
TX-S_CLOCK_SH: U2.8(A7) ; port TX-S_CLOCK_SH
TX-S_DATA: C2.2 R4.1 R23.2 U2.16(B4) U3.4(D)
TX-S_DATA_SH: U2.5(A4) ; port TX-S_DATA_SH
V_Supply: J1.5 S1.2(COM1) X2.7
VIN_E: L3.2 S1.3(NC1)
NetC10_2: C10.2 R20.2 R22.1 R36.1 U3.6(A)
NetC11_2: C11.2 R21.2 R25.1 R38.1 U4.6(A)
NetC12_1: C12.1 R18.1 R22.2 R39.1 U3.7(B)
NetC13_1: C13.1 R19.1 R25.2 R37.1 U4.7(B)
NetJ1_10: J1.10(MH1) J1.11(MH2) R28.2
NetR42_1: R42.1 U2.3(A2)
NetR43_1: R43.1 U2.1(A1)
NetR44_1: R44.1 U2.20(B1)
NetR45_1: R45.1 U2.18(B2)

Not connected (* = marked no-connect by the designer): J1 7* 8* 9*; S1 4(NO2) 5(COM2) 6(NC2); X2 5* 6*

### Channels
encoder1: designators end in A; ports READ_WRITE_CLOCK_SH=DIG_IO_11 READ_WRITE_DATA_SH=DIG_IO_5 RX-S_CLOCK_SH=DIG_IO_7 RX-S_DATA_SH=DIG_IO_1 TX-S_CLOCK_SH=DIG_IO_9 TX-S_DATA_SH=DIG_IO_3
encoder2: designators end in B; ports READ_WRITE_CLOCK_SH=DIG_IO_10 READ_WRITE_DATA_SH=DIG_IO_4 RX-S_CLOCK_SH=DIG_IO_6 RX-S_DATA_SH=DIG_IO_0 TX-S_CLOCK_SH=DIG_IO_8 TX-S_DATA_SH=DIG_IO_2
encoder3: designators end in C; ports READ_WRITE_CLOCK_SH=DIG_IO_17 READ_WRITE_DATA_SH=DIG_IO_14 RX-S_CLOCK_SH=DIG_IO_15 RX-S_DATA_SH=DIG_IO_12 TX-S_CLOCK_SH=DIG_IO_16 TX-S_DATA_SH=DIG_IO_13

### Notes on the sheet
- Power Supply Encoder
- Encoder Input
- Encoder Supply Voltage
- (near S1) 24V supply for encoder
- do not change the DSUB positions on the PCB
- (near S1) 5V supply for encoder
- TXB0108PWR
- THD1450D
- The application information for the TXB0108PWR states that the pull-up resistors should be greater than 50kOhm.
  The layout guidelines for the THD1450D state under point 6 that pull-up resistors from 1k to 10k should be used.
  Therefore, the 1k resistors are taken from the design of the “UZ_D_Encoder”
- Title
- Revision:
- Design Engineer:
- Date:
- Project:
- Sheet
- of

### Library data of the parts
C1-C6 C10-C13 = 06035A102JAT2A: Capacitor 0603, 50 VDC, 1 nF, C0G; Manufacturer: AVX; Tolerance: 5 %; Voltage Rating: 50 VDC; Created from: MGremer; Manufacturer Part Number: 06035A102JAT2A; PartID: 57; Created On: 20.12.2020 13:54:13; ComponentLink1Description: Datasheet; ComponentLink1URL: https://www.mouser.de/datasheet/2/40/C0GNP0_Dielectric-951274.pdf; Component Type: Capacitor 0603; Device Package: 0603; Last Updated: 15.02.2023 13:44:24; Mounting Type: SMD; Operating Temperature: -55 - 125°C; Series: C0G; Supplier 1: Mouser; Supplier Part Number 1: 581-06035A102J; Type: Capacitor; Value: 1 nF; Live Cycle Status: 1; LCSC Part Number: C106246; Stock number: not stored
C7-C9 C14-C16 = CC0603KRX7R9BB104: as C17 on sheet DigitalCarrierJack; Manufacturer Part Number: CC0603KRX7R9BB104; PartID: 102; Created On: 22.08.2022 14:35:53; ComponentLink1Description: Datasheet; ComponentLink1URL: https://datasheet.lcsc.com/lcsc/1809301912_YAGEO-CC0603KRX7R9BB104_C14663.pdf; Component Type: Capacitor 0603; Device Package: 0603; Last Updated: 22.08.2022 14:35:53; Mounting Type: SMD; Operating Temperature: -55 - 125°C; Series: X7R; Supplier 1: LCSC; Supplier Part Number 1: C14663; Supplier 2: Mouser; Supplier Part Number 2: 603-CC603KRX7R9BB104; Type: Capacitor; Value: 100 nF; Live Cycle Status: 1; LCSC Part Number: C14663
D4 D5 = CDSOT23-SM712: TVS Diode 7V; Manufacturer: Bourns; Polarity: Bidirectional; Type: TVS-Diode; Created from: MGremer; Category: tvs; Manufacturer Part Number: CDSOT23-SM712; Package: SOT-23; Supplier 1: Mouser; Supplier Part Number 1: 652-CDSOT23-SM712; Mounting Style: SMT; Pins: 3; Voltage: 7V; Created: 2020_09_21_MGremer; PartID: 7; Created On: 05.03.2021 11:12:07; ComponentLink1Description: Datasheet; ComponentLink1URL: https://www.mouser.de/datasheet/2/54/CDSOT23-SM712-1635169.pdf; Component Type: TVS Diode, ESD; Device Package: SOT-23-3; Last Updated: 23.11.2021 12:39:30; Mounting Type: SMD; Operating Temperature: -55 - 150°C; Series: CDSOT23-SM712; Value: 7V; Live Cycle Status: 1; Stock number: not stored
J1 = DSUB1.385-2H9: Connector; D Subminiature; 9 Position; Right Angle; Pitch 1.385 mm; Manufacturer: TE Connectivity; PackageDocument: O; Positions: 9; Gender: Receptacle; Created from: MHlatky; Published: 15-Jun-2001; LatestRevisionDate: 17-Jul-2002; LatestRevisionNote: Re-released for DXP Platform.; DatasheetDocument: 1-Sep-1999; PackageReference: 788750; Publisher: Altium Limited; Orientation: Right Angle; Manufacturer Part Number: DSUB1.385-2H9; PartID: 5; Created On: 26.01.2021 09:19:51; ComponentLink1Description: Datasheet; ComponentLink1URL: https://www.mouser.de/datasheet/2/418/7/ENG_CD_2311765_D-2072985.pdf; Component Type: DSUB Connector; Device Package: -; Last Updated: 27.05.2022 15:54:50; Type: DSUB Connector; Live Cycle Status: 1; Stock number: not stored; Supplier 1: Mouser; Supplier Part Number 1: 571-2311765-1; LCSC Part Number: C141882
L1-L3 = BLM31PG330SN1L: 9mΩ ±25% 33Ω@100MHz 6A; Manufacturer: Murata Electronics; Value: 33ohms; Created from: TGaupp; Manufacturer Part Number: BLM31PG330SN1L; PartID: 27; Created On: 03.01.2025 10:28:25; ComponentLink1Description: Datasheet; ComponentLink1URL: https://www.lcsc.com/datasheet/lcsc_datasheet_2409292303_Murata-Electronics-BLM31PG330SN1L_C74090.pdf; Component Type: Ferrite Beads; Device Package: 1206; Last Updated: 03.01.2025 10:28:25; Mounting Type: SMD; Operating Temperature: -55°C to +125°C; Series: BLM31_SN; Supplier 1: Mouser; Supplier Part Number 1: 81-BLM31P330S; Supplier 2: LCSC	C74090; Supplier Part Number 2: LCSC	C74090; Type: Ferrite_Bead; DC current: 6A; Live Cycle Status: 1; LCSC Part Number: C74090; Stock number: not stored
R3-R7 R9 R18-R21 = 0603WAF1001T5E: SMD resistor E24 series; Manufacturer: UNI-ROYAL; Tolerance: 1%; Created from: AGeiger; Manufacturer Part Number: 0603WAF1001T5E; PartID: 74; Created On: 14.12.2020 16:17:14; ComponentLink1Description: Datasheet; ComponentLink1URL: https://datasheet.lcsc.com/lcsc/2206010130_UNI-ROYAL-Uniroyal-Elec-0603WAF1001T5E_C21190.pdf; Component Type: SMD resistor; Device Package: 0603; Last Updated: 25.08.2022 16:01:46; Mounting Type: SMD; Supplier 1: LCSC; Supplier Part Number 1: C21190; Type: Resistor; Value: 1k; Live Cycle Status: 1; Stock number: Labor SMD Container; LCSC Part Number: C21190
R10-R14 R17 R26-R28 = RC0603JR-070RL: as R1 on sheet DigitalCarrierJack; Manufacturer Part Number: RC0603JR-070RL; PartID: 1; Created On: 14.12.2020 16:17:14; ComponentLink1Description: Datasheet; ComponentLink1URL: https://www.mouser.de/datasheet/2/447/PYu-RC_Group_51_RoHS_L_10-1664068.pdf; Component Type: SMD resistor; Device Package: 0603; Last Updated: 04.03.2021 09:09:42; Mounting Type: SMD; Supplier 1: Mouser; Supplier Part Number 1: 603-RC0603JR-070RL; Supplier 2: LCSC; Supplier Part Number 2: C21189; Type: Resistor; Value: 0R; Live Cycle Status: 1; Stock number: Labor SMD Container; LCSC Part Number: C21189
R15 R16 R23 R24 = RK73B1JTTD103J: SMD resistor E24 series; Manufacturer: KOA Speer; Tolerance: 5%; Created from: MGremer; Manufacturer Part Number: RK73B1JTTD103J; PartID: 98; Created On: 14.12.2020 16:17:14; ComponentLink1Description: Datasheet; ComponentLink1URL: https://www.mouser.de/datasheet/2/219/RK73B-1825463.pdf; Component Type: SMD resistor; Device Package: 0603; Last Updated: 27.05.2022 14:04:22; Mounting Type: SMD; Supplier 1: Mouser; Supplier Part Number 1: 660-RK73B1JTTD103J; Type: Resistor; Value: 10k; Live Cycle Status: 1; Stock number: Labor SMD Container; LCSC Part Number: C25804
R22 R25 = RK73B1JTTD121J: SMD resistor E24 series; Manufacturer: KOA Speer; Tolerance: 5%; Created from: MGremer; Manufacturer Part Number: RK73B1JTTD121J; PartID: 52; Created On: 14.12.2020 16:17:14; ComponentLink1Description: Datasheet; ComponentLink1URL: https://www.mouser.de/datasheet/2/219/RK73B-1825463.pdf; Component Type: SMD resistor; Device Package: 0603; Last Updated: 27.05.2022 13:40:47; Mounting Type: SMD; Supplier 1: Mouser; Supplier Part Number 1: 660-RK73B1JTTD121J; Type: Resistor; Value: 120R; Live Cycle Status: 1; Stock number: Labor SMD Container; LCSC Part Number: C22787
R36-R39 = CRCW060310R0FKTA: SMD 1/10watt 10ohms 1%; Manufacturer: Vishay; Created from: TGaupp; Manufacturer Part Number: CRCW060310R0FKTA; PartID: 296; Created On: 28.08.2023 12:16:52; ComponentLink1Description: Datasheet; ComponentLink1URL: https://www.vishay.com/docs/20008/dcrcw.pdf; Component Type: SMD resistor; Device Package: 0603; Last Updated: 23.10.2023 10:02:03; Mounting Type: SMD; Supplier 1: Mouser; Supplier Part Number 1: 71-CRCW0603-10; Type: Resistor; Tolerance: 1 %; Value: 10R; Live Cycle Status: 1; Stock number: not stored; LCSC Part Number: C2091419
R42-R45 = RK73B1JTTD104J: as R34 on sheet DigitalCarrierJack; Manufacturer Part Number: RK73B1JTTD104J; PartID: 122; Created On: 14.12.2020 16:17:14; ComponentLink1Description: Datasheet; ComponentLink1URL: https://www.mouser.de/datasheet/2/219/RK73B-1825463.pdf; Component Type: SMD resistor; Device Package: 0603; Last Updated: 27.05.2022 14:04:10; Mounting Type: SMD; Supplier 1: Mouser; Supplier Part Number 1: 660-RK73B1JTTD104J; Type: Resistor; Value: 100k; Live Cycle Status: 1; Stock number: Labor SMD Container; LCSC Part Number: C25803
S1 = SS-3235S-L1: 50mA Horizontal attachment DPDT 12V 12V 50mA 10,000 times Black SMD Slide Switches ROHS; Manufacturer: XKB Connection; Created from: AGeiger; Manufacturer Part Number: SS-3235S-L1; PartID: 49; Created On: 21.02.2024 17:10:55; ComponentLink1Description: Datasheet; ComponentLink1URL: https://www.lcsc.com/datasheet/lcsc_datasheet_2110111230_XKB-Connection-SS-3235S-L1_C500055.pdf; Component Type: Switch DPDT; Device Package: SMD; Last Updated: 23.08.2024 11:42:29; Mounting Type: SMD; Operating Temperature: -40 to +85 °C; Supplier 1: LCSC; Supplier Part Number 1: C500055; Type: Switch; Value: DPDT; Live Cycle Status: 1; LCSC Part Number: C500055
U2 = TXB0108PWR: Voltage Levels 8-Bit Bi-directional V-Level Translator; Manufacturer: Texas Instruments; Value: 3.6 - 5.5V; Created from: T.Gaupp; Manufacturer Part Number: TXB0108PWR; PartID: 11; Created On: 13.12.2024 11:01:59; ComponentLink1Description: Datasheet; ComponentLink1URL: https://www.ti.com/lit/ds/symlink/txb0108.pdf?ts=1734008122008&ref_url=https%253A%252F%252Fwww.mouser.de%252F; Component Type: Level Shifter; Device Package: TSSOP-20; Last Updated: 03.01.2025 11:10:35; Mounting Type: SMD; Operating Temperature: -40 to +85 °C; Series: TXB0108; Supplier 1: Mouser; Supplier Part Number 1: 595-TXB0108PWR; Supplier 2: LCSC; Supplier Part Number 2: C53406; Type: Level Shifter; Live Cycle Status: 1; Stock number: not stored; LCSC Part Number: C53406
U3 U4 = THVD1450DR: 3.3-V to 5-V RS-485 transceiver with +/-18-kV IEC ESD protection 8-SOIC -40 to 125; Manufacturer: Texas Instruments; Created from: TGaupp; Manufacturer Part Number: THVD1450DR; PartID: 11; Created On: 03.01.2025 12:54:38; ComponentLink1Description: Datasheet; ComponentLink1URL: https://www.ti.com/lit/ds/symlink/thvd1450.pdf?ts=1735896970492&ref_url=https%253A%252F%252Fwww.ti.com%252Fproduct%252FTHVD1450; Component Type: RS-485 transceiver; Device Package: SOIC-8; Last Updated: 03.01.2025 12:54:38; Minimum Order: 1; Mounting Type: SMD; Operating Temperature: -40 - 125 °C; Series: THVD1450; Supplier 1: Mouser; Supplier Part Number 1: 595-THVD1450DR; Supplier 2: LCSC; Supplier Part Number 2: C2671361; Type: Standard; Live Cycle Status: 1; Stock number: not stored; LCSC Part Number: C2671361
X2 = 103741-8: 8 Pin; Manufacturer: TE Connectivity; Created from: MHlatky; Manufacturer Part Number: 103741-8; PartID: 9; Created On: 22.11.2021 15:31:45; ComponentLink1Description: Datasheet; ComponentLink1URL: https://www.mouser.de/datasheet/2/427/VISH_S_A0003529023_1-2568887.pdf; Component Type: Pin Header; Last Updated: 21.03.2022 12:19:22; Supplier 1: Mouser; Supplier Part Number 1: 571-103741-8; Type: Pin Header; Live Cycle Status: 1; Stock number: not stored

## Nets that join several sheets
3V3_PER_fused: DigitalCarrierJack (F3.2 R30.2), encoder1 (L1A.1), encoder2 (L1B.1), encoder3 (L1C.1)
5V_PER_fused: DigitalCarrierJack (F2.2 R29.2), encoder1 (L2A.1), encoder2 (L2B.1), encoder3 (L2C.1)
GND: DigitalCarrierJack (52 pins), encoder1 (34 pins), encoder2 (34 pins), encoder3 (34 pins)
VIN_fused: DigitalCarrierJack (F1.2 R8.2), encoder1 (L3A.1), encoder2 (L3B.1), encoder3 (L3C.1)
DIG_IO_0: DigitalCarrierJack (X1.17), encoder2 (U2B.4)
DIG_IO_1: DigitalCarrierJack (X1.18), encoder1 (U2A.4)
DIG_IO_2: DigitalCarrierJack (X1.21), encoder2 (U2B.5)
DIG_IO_3: DigitalCarrierJack (X1.22), encoder1 (U2A.5)
DIG_IO_4: DigitalCarrierJack (X1.25), encoder2 (U2B.6)
DIG_IO_5: DigitalCarrierJack (X1.26), encoder1 (U2A.6)
DIG_IO_6: DigitalCarrierJack (X1.29), encoder2 (U2B.7)
DIG_IO_7: DigitalCarrierJack (X1.30), encoder1 (U2A.7)
DIG_IO_8: DigitalCarrierJack (X1.33), encoder2 (U2B.8)
DIG_IO_9: DigitalCarrierJack (X1.34), encoder1 (U2A.8)
DIG_IO_10: DigitalCarrierJack (X1.37), encoder2 (U2B.9)
DIG_IO_11: DigitalCarrierJack (X1.38), encoder1 (U2A.9)
DIG_IO_12: DigitalCarrierJack (X1.41), encoder3 (U2C.4)
DIG_IO_13: DigitalCarrierJack (X1.42), encoder3 (U2C.5)
DIG_IO_14: DigitalCarrierJack (X1.45), encoder3 (U2C.6)
DIG_IO_15: DigitalCarrierJack (X1.46), encoder3 (U2C.7)
DIG_IO_16: DigitalCarrierJack (X1.49), encoder3 (U2C.8)
DIG_IO_17: DigitalCarrierJack (X1.50), encoder3 (U2C.9)

## Assembly variants
Default: not fitted C1A C1B C1C C2A C2B C2C C3A C3B C3C C4A C4B C4C C5A C5B C5C C6A C6B C6C R1 R3A R3B R3C R4A R4B R4C R5A R5B R5C R6A R6B R6C R7A R7B R7C R9A R9B R9C R28A R28B R28C X2A X2B X2C